# EAGLE schematic merkur-connect-pi-expansionboard (EAGLE 6.4)
REVISION: 1.0
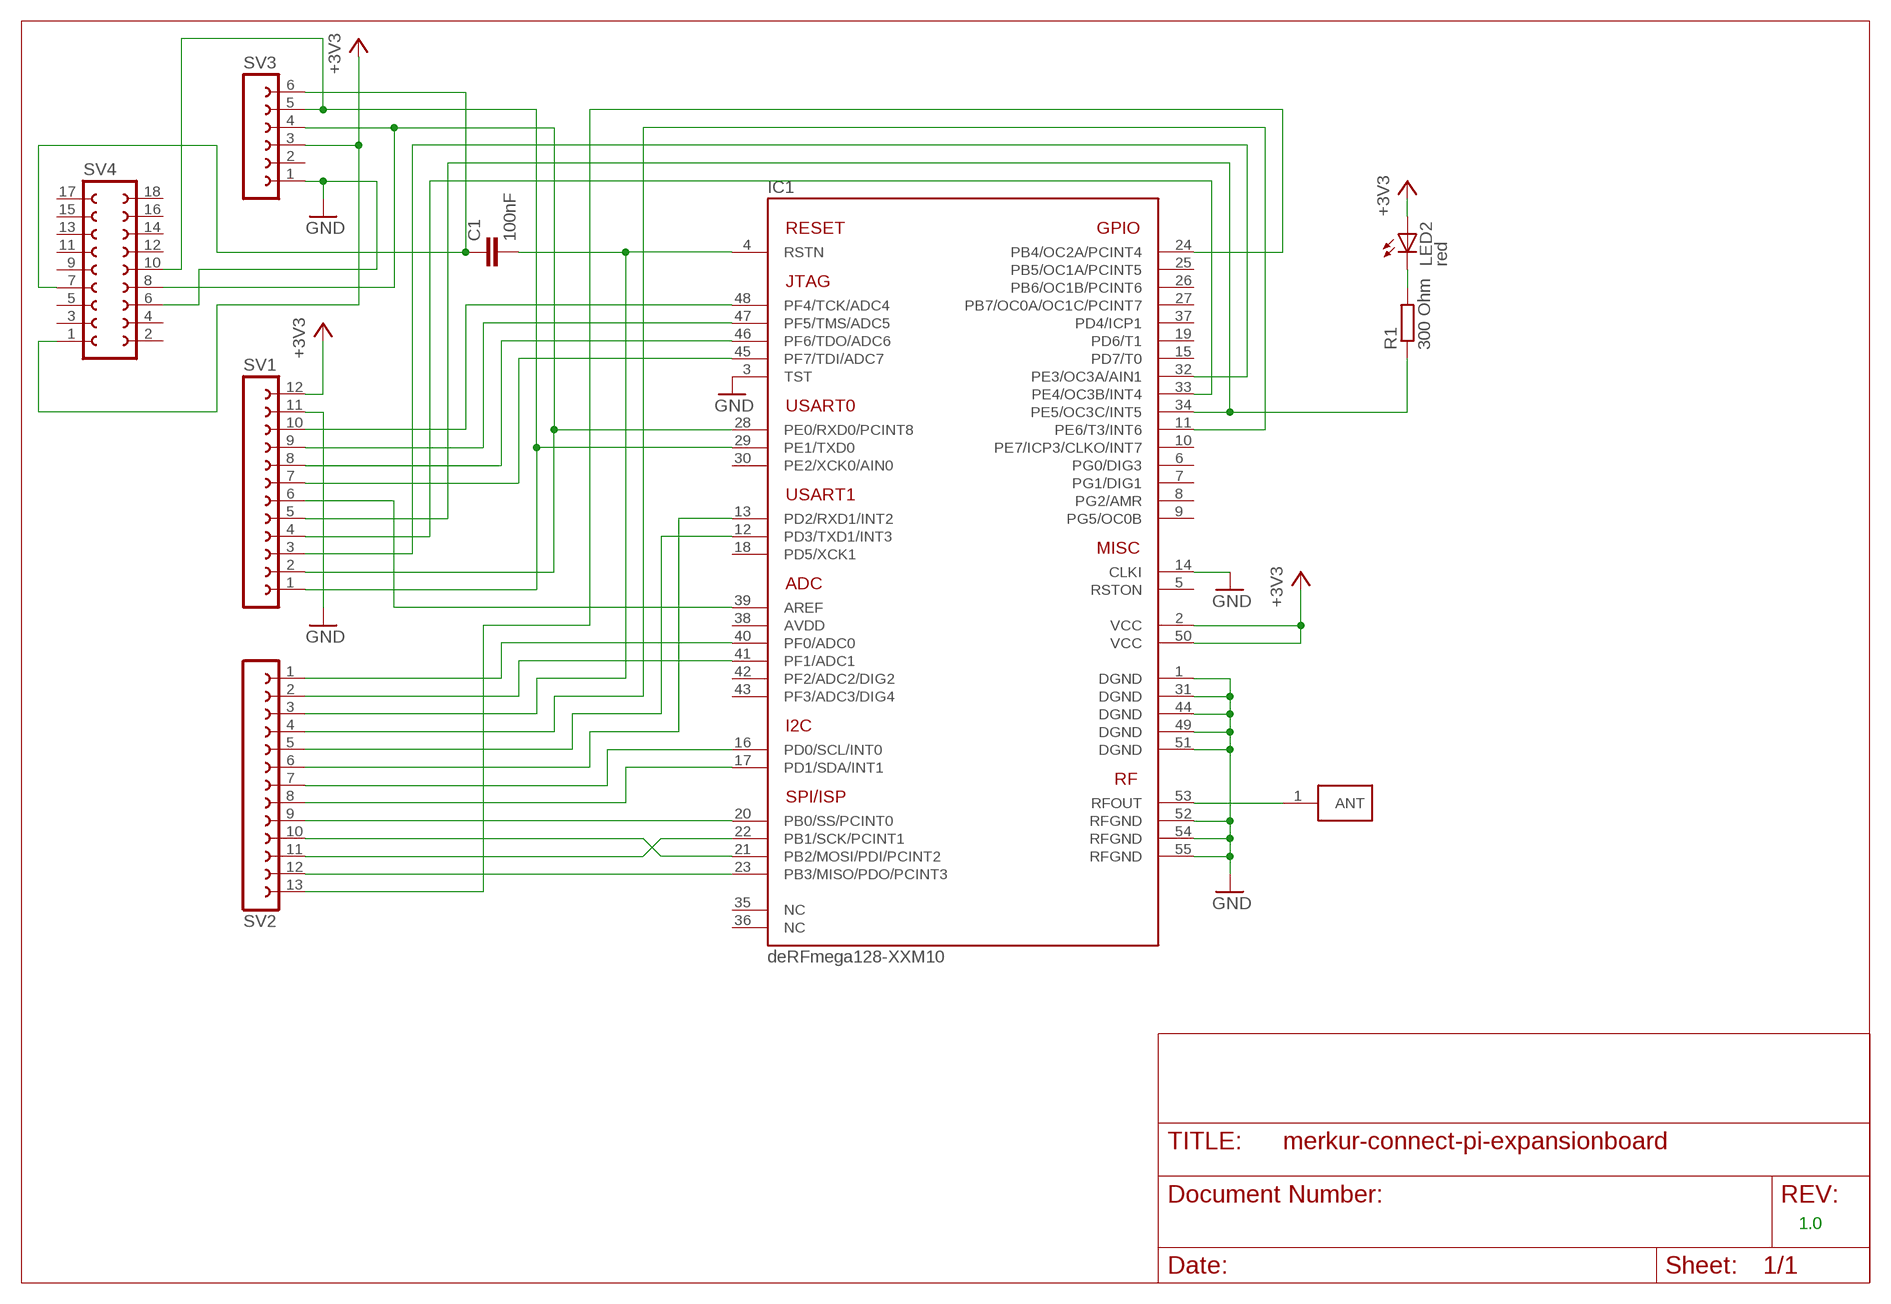
[diagram p0: schematic, sheet 1]

## Parts
C1  100nF  C-EUC0603  [C0603]
IC1  DERFMEGA128-XXM10  [A-M10]
LED2  red  LEDCHIP-LED0603  [CHIP-LED0603]
R1  300 Ohm  R-EU_R0603  [R0603]
SV1  FE12-1  [FE12]
SV2  FE13-1  [FE13]
SV3  FE06-1  [FE06]
SV4  FE09-2  [FE09-2]
U$1  PAD  [FE05-1]

## Nets
+3V3: IC1.2(VCC) IC1.50(VCC) LED2.A SV1.12 SV3.3 SV4.1
GND: IC1.1(DGND) IC1.3(TST) IC1.14(CLKI) IC1.31(DGND) IC1.44(DGND) IC1.49(DGND) IC1.51(DGND) IC1.52(RFGND) IC1.54(RFGND) IC1.55(RFGND) SV1.11 SV3.1 SV4.6
N$1: IC1.29(PE1/TXD0) SV1.1 SV3.5 SV4.10
N$2: IC1.28(PE0/RXD0/PCINT8) SV1.2 SV3.4 SV4.8
N$3: IC1.45(PF7/TDI/ADC7) SV1.7
N$4: IC1.46(PF6/TDO/ADC6) SV1.8
N$5: IC1.47(PF5/TMS/ADC5) SV1.9
N$6: IC1.48(PF4/TCK/ADC4) SV1.10
N$7: C1.2 IC1.4(RSTN) SV2.3
N$8: IC1.34(PE5/OC3C/INT5) R1.1 SV1.5
N$9: IC1.33(PE4/OC3B/INT4) SV1.4
N$10: IC1.32(PE3/OC3A/AIN1) SV1.3
N$11: IC1.17(PD1/SDA/INT1) SV2.8
N$12: IC1.16(PD0/SCL/INT0) SV2.7
N$13: IC1.20(PB0/SS/PCINT0) SV2.9
N$14: IC1.22(PB1/SCK/PCINT1) SV2.11
N$15: IC1.21(PB2/MOSI/PDI/PCINT2) SV2.10
N$16: IC1.23(PB3/MISO/PDO/PCINT3) SV2.12
N$17: IC1.13(PD2/RXD1/INT2) SV2.6
N$18: IC1.12(PD3/TXD1/INT3) SV2.5
N$19: IC1.11(PE6/T3/INT6) SV2.4
N$20: IC1.41(PF1/ADC1) SV2.2
N$21: IC1.40(PF0/ADC0) SV2.1
N$22: IC1.39(AREF) SV1.6
N$23: LED2.C R1.2
N$24: IC1.24(PB4/OC2A/PCINT4) SV2.13
N$27: C1.1 SV3.6 SV4.7
RFOUT: IC1.53(RFOUT) U$1.1(ANT)
Unconnected: IC1.5(RSTON) IC1.6(PG0/DIG3) IC1.7(PG1/DIG1) IC1.8(PG2/AMR) IC1.9(PG5/OC0B) IC1.10(PE7/ICP3/CLKO/INT7) IC1.15(PD7/T0) IC1.18(PD5/XCK1) IC1.19(PD6/T1) IC1.25(PB5/OC1A/PCINT5) IC1.26(PB6/OC1B/PCINT6) IC1.27(PB7/OC0A/OC1C/PCINT7) IC1.30(PE2/XCK0/AIN0) IC1.35(NC) IC1.36(NC) IC1.37(PD4/ICP1) IC1.38(AVDD) IC1.42(PF2/ADC2/DIG2) IC1.43(PF3/ADC3/DIG4) SV3.2 SV4.2 SV4.3 SV4.4 SV4.5 SV4.9 SV4.11 SV4.12 SV4.13 SV4.14 SV4.15 SV4.16 SV4.17 SV4.18

## Library data of the parts
C1 = rcl:C-EU: CAPACITOR, European symbol
IC1 = deRFmodules:DERFMEGA128-XXM10: deRFmega128 IEEE 802.15.4 Low Power Wireless Radio Module Microcontroller: Atmel ATmega128RFA1 Transceiver: integrated Manufacturer: dresden elektronik ingenieurtechnik gmbh Website: http://www.dresden-elektronik.de
LED2 = led:LED: LED OSRAM: - CHIPLED LG R971, LG N971, LY N971, LG Q971, LY Q971, LO R971, LY R971 LH N974, LH R974 LS Q976, LO Q976, LY Q976 LO Q996 - Hyper CHIPLED LW Q18S LB Q993, LB Q99A, LB R99A - SideLED LS A670, LO A670, LY A670, LG A670, LP A670 LB A673, LV A673, LT A673, LW A673 LH A674 LY A675 LS A676, LA A676, LO A676, LY A676, LW A676 LS A679, LY A679, LG A679 - Hyper Micro SIDELED® LS Y876, LA Y876, LO Y876, LY Y876 LT Y87S - SmartLED LW L88C, LW L88S LB L89C, LB L89S, LG L890 LS L89K, LO L89K, LY L89K LS L896, LA L896, LO L896, LY L896 - TOPLED LS T670, LO T670, LY T670, LG T670, LP T670 LSG T670, LSP T670, LSY T670, LOP T670, LYG T670 LG T671, LOG T671, LSG T671 LB T673, LV T673, LT T673, LW T673 LH T674 LS T676, LA T676, LO T676, LY T676, LB T676, LH T676, LSB T676, LW T676 LB T67C, LV T67C, LT T67C, LS T67K, LO T67K, LY T67K, LW E67C LS E67B, LA E67B, LO E67B, LY E67B, LB E67C, LV E67C, LT E67C LW T67C LS T679, LY T679, LG T679 LS T770, LO T770, LY T770, LG T770, LP T770 LB T773, LV T773, LT T773, LW T773 LH T774 LS E675, LA E675, LY E675, LS T675 LS T776, LA T776, LO T776, LY T776, LB T776 LHGB T686 LT T68C, LB T68C - Hyper Mini TOPLED® LB M676 - Mini TOPLED Santana® LG M470 LS M47K, LO M47K, LY M47K Source: http://www.osram.convergy.de LUXEON: - LUMILED® LXK2-PW12-R00, LXK2-PW12-S00, LXK2-PW14-U00, LXK2-PW14-V00 LXK2-PM12-R00, LXK2-PM12-S00, LXK2-PM14-U00 LXK2-PE12-Q00, LXK2-PE12-R00, LXK2-PE12-S00, LXK2-PE14-T00, LXK2-PE14-U00 LXK2-PB12-K00, LXK2-PB12-L00, LXK2-PB12-M00, LXK2-PB14-N00, LXK2-PB14-P00, LXK2-PB14-Q00 LXK2-PR12-L00, LXK2-PR12-M00, LXK2-PR14-Q00, LXK2-PR14-R00 LXK2-PD12-Q00, LXK2-PD12-R00, LXK2-PD12-S00 LXK2-PH12-R00, LXK2-PH12-S00 LXK2-PL12-P00, LXK2-PL12-Q00, LXK2-PL12-R00 Source: www.luxeon.com KINGBRIGHT: KA-3528ASYC Source: www.kingbright.com
R1 = rcl:R-EU_: RESISTOR, European symbol
SV1 = con-lsta:FE12-1: FEMALE HEADER; OC_FARNELL: unknown; OC_NEWARK: unknown
SV2 = con-lsta:FE13-1: FEMALE HEADER; OC_FARNELL: unknown; OC_NEWARK: unknown
SV3 = con-lsta:FE06-1: FEMALE HEADER; OC_FARNELL: unknown; OC_NEWARK: unknown
SV4 = con-lsta:FE09-2: FEMALE HEADER; OC_FARNELL: unknown; OC_NEWARK: unknown
U$1 = Pad:PAD